# Altium schematic sheet Power and Connectors.SchDoc
size 241 x 190 mm; SheetNumber: 2; SheetTotal: 3
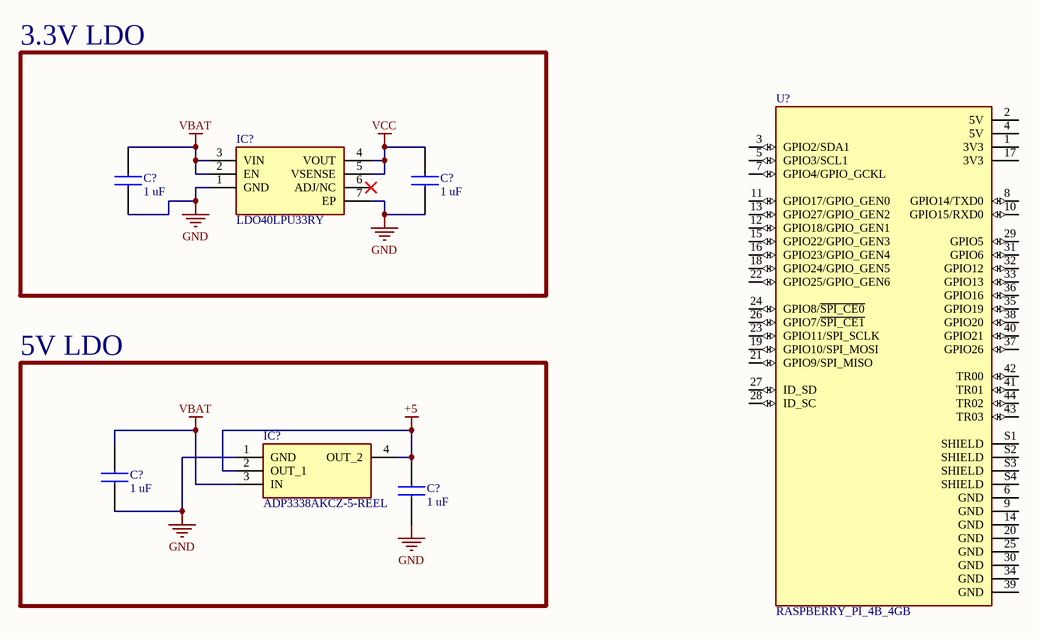
[diagram p0: Power and Connectors.SchDoc]

## Parts
(Parts that share a designator on the sheet are numbered #1, #2 ... from top to bottom, then left to right.)
C?#1  1 uF  [CAP_0603]
C?#2  1 uF  [CAP_0603]
C?#3  1 uF  [CAP_0603]
C?#4  1 uF  [CAP_0603]
IC?#1  LDO40LPU33RY  [SON95P300X300X90-7N-D]
IC?#2  ADP3338AKCZ-5-REEL  [SOT230P700X180-4N]
U?  RASPBERRY_PI_4B_4GB  [MODULE_RASPBERRY_PI_4B_4GB]

## Blocks framed on the sheet
3.3V LDO: C?#1 C?#2 IC?#1
5V LDO: C?#3 C?#4 IC?#2

## Nets
+5: C?#4.2 IC?#2.2(OUT_1) IC?#2.4(OUT_2)
GND: C?#1.1 C?#2.1 C?#3.1 C?#4.1 IC?#1.1(GND) IC?#1.7(EP) IC?#2.1(GND)
VBAT: C?#1.2 C?#3.2 IC?#1.2(EN) IC?#1.3(VIN) IC?#2.3(IN)
VCC: C?#2.2 IC?#1.4(VOUT) IC?#1.5(VSENSE)

Not connected (* = marked no-connect by the designer): IC?#1 6(ADJ/NC)*; U? 1(3V3) 2(5V) 3(GPIO2/SDA1) 4(5V) 5(GPIO3/SCL1) 6(GND) 7(GPIO4/GPIO_GCKL) 8(GPIO14/TXD0) 9(GND) 10(GPIO15/RXD0) 11(GPIO17/GPIO_GEN0) 12(GPIO18/GPIO_GEN1) 13(GPIO27/GPIO_GEN2) 14(GND) 15(GPIO22/GPIO_GEN3) 16(GPIO23/GPIO_GEN4) 17(3V3) 18(GPIO24/GPIO_GEN5) 19(GPIO10/SPI_MOSI) 20(GND) 21(GPIO9/SPI_MISO) 22(GPIO25/GPIO_GEN6) 23(GPIO11/SPI_SCLK) 24(GPIO8/~{SPI_CE0}) 25(GND) 26(GPIO7/~{SPI_CE1}) 27(ID_SD) 28(ID_SC) 29(GPIO5) 30(GND) 31(GPIO6) 32(GPIO12) 33(GPIO13) 34(GND) 35(GPIO19) 36(GPIO16) 37(GPIO26) 38(GPIO20) 39(GND) 40(GPIO21) 41(TR01) 42(TR00) 43(TR03) 44(TR02) S1(SHIELD) S2(SHIELD) S3(SHIELD) S4(SHIELD)

## Notes on the sheet
- Title
- Author
- Date
- Texas A&M Sounding Rocketry Team
- Revision

## Library data of the parts
C?#1-C?#4 = 1 uF Capacitor, 0603: Multilayer Ceramic Capacitors MLCC - SMD/SMT KGM15BR71H224JT NEW GLOBAL PN 50V 0.22uF A 581-KGM15BR71H224JT; Manufacturer 1: KYOCERA AVX; Manufacturer Part Number 1: 06033C105KAT2A; Tolerance: 10%; Voltage: 25 V; Value: 1 uF; Package: 0603; Library Ref: Capacitor_BASE; Design Item ID: 1 uF Capacitor, 0603; Supplier 1: Mouser; Supplier Part Number 1: 581-06033C105KAT2A
IC?#1 = LDO40LPU33RY: 3.3V 400 mA LDO; Manufacturer_Name: STMicroelectronics; Datasheet Link: https://www.st.com/resource/en/datasheet/ldo40l.pdf; Height: 0.9mm; Manufacturer_Part_Number: LDO40LPU33RY; Mouser Part Number: 511-LDO40LPU33RY; Mouser Price/Stock: https://www.mouser.co.uk/ProductDetail/STMicroelectronics/LDO40LPU33RY?qs=qSfuJ%252Bfl%2Fd5qazWclm%2Ffpg%3D%3D; Arrow Part Number: LDO40LPU33RY; Arrow Price/Stock: https://www.arrow.com/en/products/ldo40lpu33ry/stmicroelectronics?utm_currency=USD&region=europe; Supplier 1: Mouser; Supplier Part Number 1: 511-LDO40LPU33RY; Supplier 2: DigiKey; Supplier Part Number 2: 497-18288-1-ND
IC?#2 = ADP3338AKCZ-5-REEL: Integrated Circuit; Manufacturer_Name: Analog Devices; Datasheet Link: https://www.analog.com/media/en/technical-documentation/data-sheets/ADP3338.pdf; Height: 1.8mm; Manufacturer_Part_Number: ADP3338AKCZ-5-REEL; Mouser Part Number: 584-ADP3338AKCZ5-R; Mouser Price/Stock: https://www.mouser.co.uk/ProductDetail/Analog-Devices/ADP3338AKCZ-5-REEL?qs=WIvQP4zGanhim2Tr9nM7fw%3D%3D; Arrow Part Number: ADP3338AKCZ-5-REEL; Arrow Price/Stock: https://www.arrow.com/en/products/adp3338akcz-5-reel/analog-devices?utm_currency=USD&region=nac
U? = RASPBERRY_PI_4B_4GB: BCM2711 Raspberry Pi 4 Model B 4GB - ARMÂ® CortexÂ®-A72 MPU Embedded Evaluation Board; MP: RASPBERRY PI 4B/4GB; SnapEDA_Link: https://www.snapeda.com/parts/RASPBERRY%20PI%204B/4GB/Raspberry+Pi/view-part/?ref=snap; Package: None; Value: *; MF: Raspberry Pi; Check_prices: https://www.snapeda.com/parts/RASPBERRY%20PI%204B/4GB/Raspberry+Pi/view-part/?ref=eda